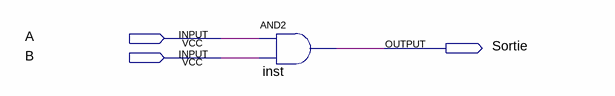
[diagram p0: schematic sheet]
// Quartus schematic PorteET.bdf as structural Verilog: 1 symbols, 3 pins
module PorteET (
  input  A,
  input  B,
  output Sortie
);

  and inst (Sortie, A, B);
endmodule
